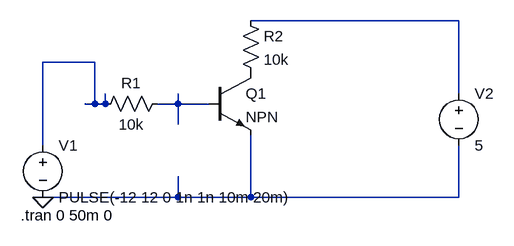
[diagram p0: schematic phone-logic-shift.asc]
phone-logic-shift.asc, the LTspice schematic file:
Version 4
SHEET 1 880 680
WIRE 624 -80 304 -80
WIRE 64 -16 -16 -16
WIRE 624 32 624 -80
WIRE 64 48 64 -16
WIRE 64 48 48 48
WIRE 80 48 80 32
WIRE 80 48 64 48
WIRE 192 48 192 32
WIRE 192 48 160 48
WIRE 240 48 192 48
WIRE 192 80 192 48
WIRE -16 112 -16 -16
WIRE 192 192 192 160
WIRE 192 192 -16 192
WIRE 304 192 304 96
WIRE 304 192 192 192
WIRE 624 192 624 112
WIRE 624 192 304 192
FLAG -16 192 0
SYMBOL voltage -16 96 R0
WINDOW 123 0 0 Left 0
WINDOW 39 0 0 Left 0
SYMATTR InstName V1
SYMATTR Value PULSE(-12 12 0 1n 1n 10m 20m)
SYMBOL res 176 32 R90
WINDOW 0 0 56 VBottom 0
WINDOW 3 32 56 VTop 0
SYMATTR InstName R1
SYMATTR Value 10k
SYMBOL npn 240 0 R0
SYMATTR InstName Q1
SYMBOL res 288 -96 R0
SYMATTR InstName R2
SYMATTR Value 10k
SYMBOL voltage 624 16 R0
WINDOW 123 0 0 Left 0
WINDOW 39 0 0 Left 0
SYMATTR InstName V2
SYMATTR Value 5
TEXT -50 220 Left 0 !.tran 0 50m 0

The netlist it stands for:
* phone-logic-shift.asc
V1 N002 0 PULSE(-12 12 0 1n 1n 10m 20m)
R1 N003 N002 10k
Q1 P001 N003 0 0 NPN
R2 N001 P001 10k
V2 N001 0 5
.model NPN NPN
.model PNP PNP
.lib standard.bjt
.tran 0 50m 0
.backanno
.end